# Altium project STB_LightBoard.PrjPcb (part 1 of 10)
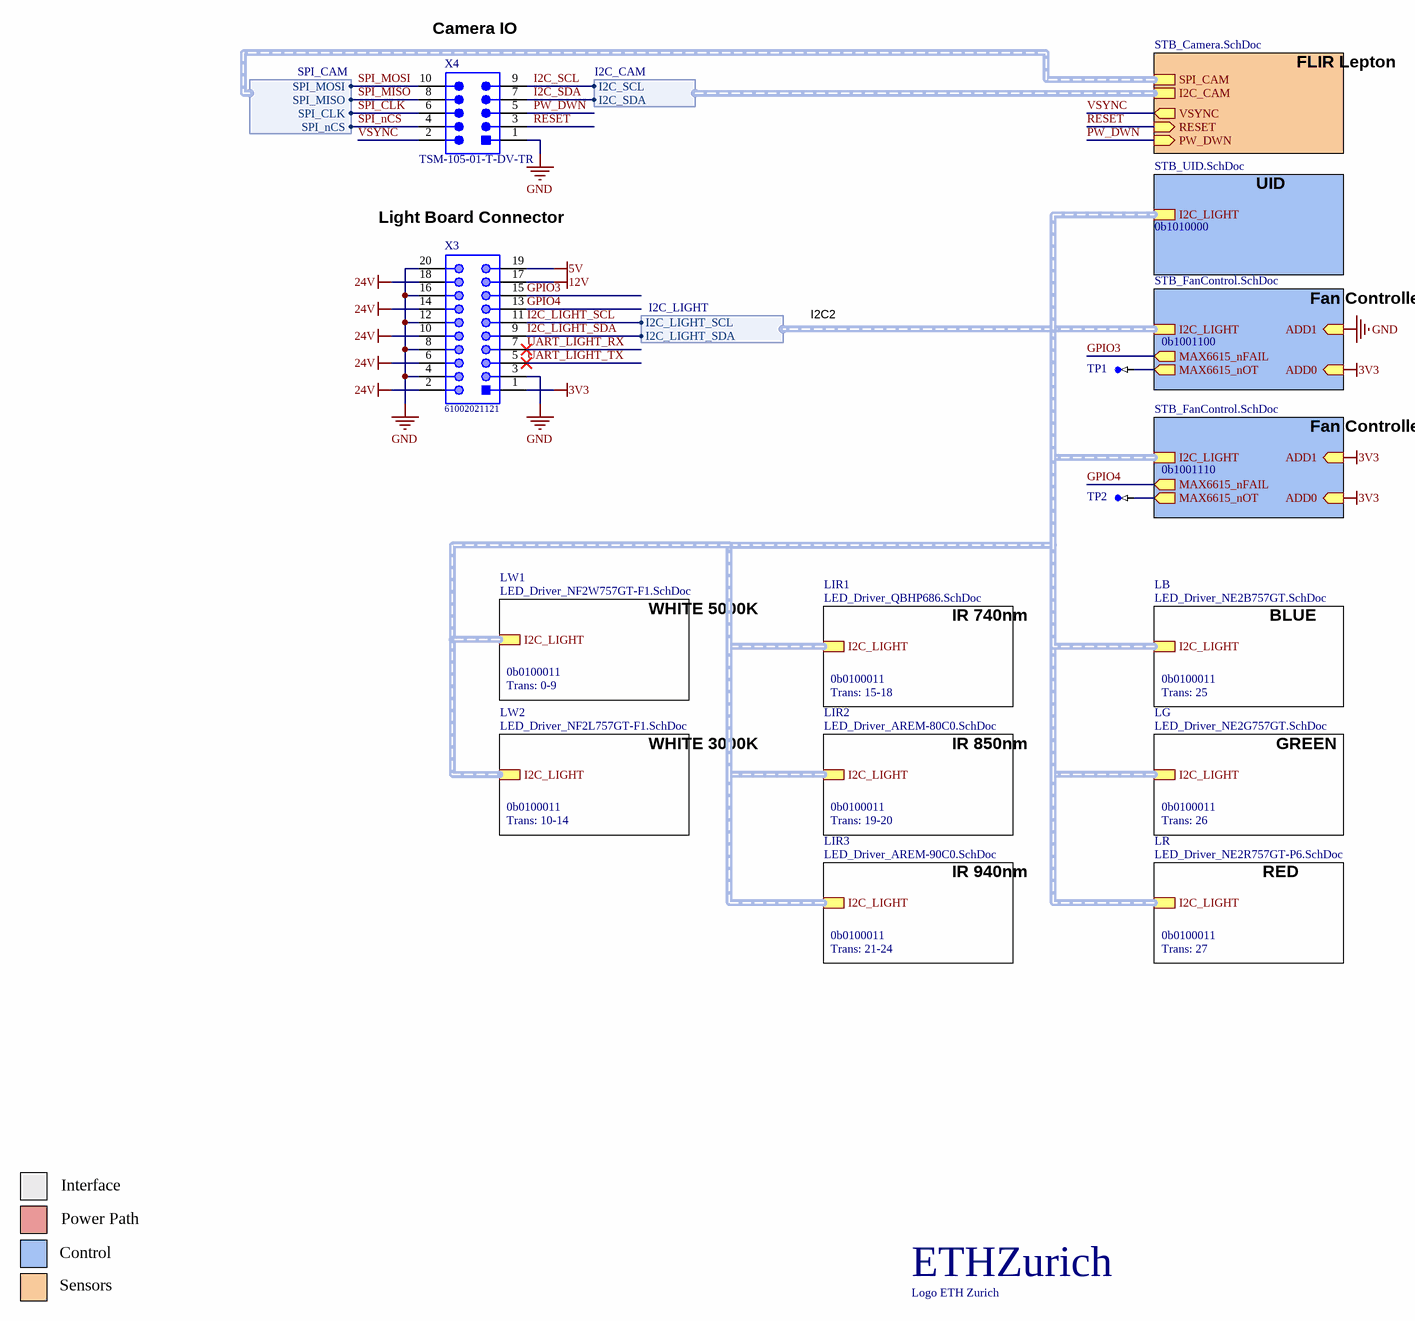
[diagram p0: STB_LightBoard.SchDoc]
21 sheets, 3811 parts. Net scope: hierarchical (ports join the sheet entries above them; power ports are global).
Board file: STB_LightBoard.PcbDoc
Sheets:
  STB_LightBoard.SchDoc
    UID = STB_UID.SchDoc
    TC1 = STB_FanControl.SchDoc
    TC2 = STB_FanControl.SchDoc
    LG = LED_Driver_NE2G757GT.SchDoc
      D26 = STB_Driver_ISL78171.SchDoc
      g_10 = LED_String_NE2G757GT.SchDoc
      g_11 = LED_String_NE2G757GT.SchDoc
      g_12 = LED_String_NE2G757GT.SchDoc
      g_13 = LED_String_NE2G757GT.SchDoc
      g_14 = LED_String_NE2G757GT.SchDoc
      g_15 = LED_String_NE2G757GT.SchDoc
    LIR1 = LED_Driver_QBHP686.SchDoc
      D15 = STB_Driver_ISL78171.SchDoc
      IR740_10 = LED_String_QBHP686.SchDoc
      IR740_11 = LED_String_QBHP686.SchDoc
      IR740_12 = LED_String_QBHP686.SchDoc
      IR740_13 = LED_String_QBHP686.SchDoc
      IR740_14 = LED_String_QBHP686.SchDoc
      IR740_15 = LED_String_QBHP686.SchDoc
      D16 = STB_Driver_ISL78171.SchDoc
      IR740_20 = LED_String_QBHP686.SchDoc
      IR740_21 = LED_String_QBHP686.SchDoc
      IR740_22 = LED_String_QBHP686.SchDoc
      IR740_23 = LED_String_QBHP686.SchDoc
      IR740_24 = LED_String_QBHP686.SchDoc
      IR740_25 = LED_String_QBHP686.SchDoc
      D17 = STB_Driver_ISL78171.SchDoc
      IR740_30 = LED_String_QBHP686.SchDoc
      IR740_31 = LED_String_QBHP686.SchDoc
      IR740_32 = LED_String_QBHP686.SchDoc
      IR740_33 = LED_String_QBHP686.SchDoc
      IR740_34 = LED_String_QBHP686.SchDoc
      IR740_35 = LED_String_QBHP686.SchDoc
      D18 = STB_Driver_ISL78171.SchDoc
      IR740_40 = LED_String_QBHP686.SchDoc
      IR740_41 = LED_String_QBHP686.SchDoc
      IR740_42 = LED_String_QBHP686.SchDoc
      IR740_43 = LED_String_QBHP686.SchDoc
      IR740_44 = LED_String_QBHP686.SchDoc
      IR740_45 = LED_String_QBHP686.SchDoc
    LIR2 = LED_Driver_AREM-80C0.SchDoc
      D19 = STB_Driver_ISL78171.SchDoc
      IR850_10 = LED_String_AREM-80C0.SchDoc
      IR850_11 = LED_String_AREM-80C0.SchDoc
      IR850_12 = LED_String_AREM-80C0.SchDoc
      IR850_13 = LED_String_AREM-80C0.SchDoc
      IR850_14 = LED_String_AREM-80C0.SchDoc
      IR850_15 = LED_String_AREM-80C0.SchDoc
      D20 = STB_Driver_ISL78171.SchDoc
      IR850_20 = LED_String_AREM-80C0.SchDoc
      IR850_21 = LED_String_AREM-80C0.SchDoc
      IR850_22 = LED_String_AREM-80C0.SchDoc
      IR850_23 = LED_String_AREM-80C0.SchDoc
      IR850_24 = LED_String_AREM-80C0.SchDoc
      IR850_25 = LED_String_AREM-80C0.SchDoc
    LIR3 = LED_Driver_AREM-90C0.SchDoc
      D21 = STB_Driver_ISL78171.SchDoc
      IR940_10 = LED_String_AREM-90C0.SchDoc
      IR940_11 = LED_String_AREM-90C0.SchDoc
      IR940_12 = LED_String_AREM-90C0.SchDoc
      IR940_13 = LED_String_AREM-90C0.SchDoc
      IR940_14 = LED_String_AREM-90C0.SchDoc
      IR940_15 = LED_String_AREM-90C0.SchDoc
      D22 = STB_Driver_ISL78171.SchDoc
      IR940_20 = LED_String_AREM-90C0.SchDoc
      IR940_21 = LED_String_AREM-90C0.SchDoc
      IR940_22 = LED_String_AREM-90C0.SchDoc
      IR940_23 = LED_String_AREM-90C0.SchDoc
      IR940_24 = LED_String_AREM-90C0.SchDoc
      IR940_25 = LED_String_AREM-90C0.SchDoc
      D23 = STB_Driver_ISL78171.SchDoc
      IR940_30 = LED_String_AREM-90C0.SchDoc
      IR940_31 = LED_String_AREM-90C0.SchDoc
      IR940_32 = LED_String_AREM-90C0.SchDoc
      IR940_33 = LED_String_AREM-90C0.SchDoc
      IR940_34 = LED_String_AREM-90C0.SchDoc
      IR940_35 = LED_String_AREM-90C0.SchDoc
      D24 = STB_Driver_ISL78171.SchDoc
      IR940_40 = LED_String_AREM-90C0.SchDoc
      IR940_41 = LED_String_AREM-90C0.SchDoc
      IR940_42 = LED_String_AREM-90C0.SchDoc
      IR940_43 = LED_String_AREM-90C0.SchDoc
      IR940_44 = LED_String_AREM-90C0.SchDoc
      IR940_45 = LED_String_AREM-90C0.SchDoc
    LW2 = LED_Driver_NF2L757GT-F1.SchDoc
      D10 = STB_Driver_ISL78171.SchDoc
      W3_10 = LED_String_NF2L757GT-F1.SchDoc
      W3_11 = LED_String_NF2L757GT-F1.SchDoc
      W3_12 = LED_String_NF2L757GT-F1.SchDoc
      W3_13 = LED_String_NF2L757GT-F1.SchDoc
      W3_14 = LED_String_NF2L757GT-F1.SchDoc
      W3_15 = LED_String_NF2L757GT-F1.SchDoc
      D11 = STB_Driver_ISL78171.SchDoc
      W3_20 = LED_String_NF2L757GT-F1.SchDoc
      W3_21 = LED_String_NF2L757GT-F1.SchDoc
      W3_22 = LED_String_NF2L757GT-F1.SchDoc
      W3_23 = LED_String_NF2L757GT-F1.SchDoc
      W3_24 = LED_String_NF2L757GT-F1.SchDoc
      W3_25 = LED_String_NF2L757GT-F1.SchDoc
      D12 = STB_Driver_ISL78171.SchDoc
      W3_30 = LED_String_NF2L757GT-F1.SchDoc
      W3_31 = LED_String_NF2L757GT-F1.SchDoc
      W3_32 = LED_String_NF2L757GT-F1.SchDoc
      W3_33 = LED_String_NF2L757GT-F1.SchDoc
      W3_34 = LED_String_NF2L757GT-F1.SchDoc
      W3_35 = LED_String_NF2L757GT-F1.SchDoc
      D13 = STB_Driver_ISL78171.SchDoc
      W3_40 = LED_String_NF2L757GT-F1.SchDoc
      W3_41 = LED_String_NF2L757GT-F1.SchDoc
      W3_42 = LED_String_NF2L757GT-F1.SchDoc
      W3_43 = LED_String_NF2L757GT-F1.SchDoc
      W3_44 = LED_String_NF2L757GT-F1.SchDoc
      W3_45 = LED_String_NF2L757GT-F1.SchDoc
      D14 = STB_Driver_ISL78171.SchDoc
      W3_50 = LED_String_NF2L757GT-F1.SchDoc
      W3_51 = LED_String_NF2L757GT-F1.SchDoc
      W3_52 = LED_String_NF2L757GT-F1.SchDoc
      W3_53 = LED_String_NF2L757GT-F1.SchDoc
      W3_54 = LED_String_NF2L757GT-F1.SchDoc
      W3_55 = LED_String_NF2L757GT-F1.SchDoc
    LW1 = LED_Driver_NF2W757GT-F1.SchDoc
      D0 = STB_Driver_ISL78171.SchDoc
      D1 = STB_Driver_ISL78171.SchDoc
      D2 = STB_Driver_ISL78171.SchDoc
      D3 = STB_Driver_ISL78171.SchDoc
      D5 = STB_Driver_ISL78171.SchDoc
      D6 = STB_Driver_ISL78171.SchDoc
      D7 = STB_Driver_ISL78171.SchDoc
      D4 = STB_Driver_ISL78171.SchDoc
      D9 = STB_Driver_ISL78171.SchDoc
      D8 = STB_Driver_ISL78171.SchDoc
      W5_10 = LED_String_NF2W757GT-F1.SchDoc
      W5_11 = LED_String_NF2W757GT-F1.SchDoc
      W5_12 = LED_String_NF2W757GT-F1.SchDoc
      W5_13 = LED_String_NF2W757GT-F1.SchDoc
      W5_14 = LED_String_NF2W757GT-F1.SchDoc
      W5_20 = LED_String_NF2W757GT-F1.SchDoc
      W5_21 = LED_String_NF2W757GT-F1.SchDoc
      W5_22 = LED_String_NF2W757GT-F1.SchDoc
      W5_23 = LED_String_NF2W757GT-F1.SchDoc
      W5_24 = LED_String_NF2W757GT-F1.SchDoc
      W5_25 = LED_String_NF2W757GT-F1.SchDoc
      W5_30 = LED_String_NF2W757GT-F1.SchDoc
      W5_31 = LED_String_NF2W757GT-F1.SchDoc
      W5_32 = LED_String_NF2W757GT-F1.SchDoc
      W5_33 = LED_String_NF2W757GT-F1.SchDoc
      W5_34 = LED_String_NF2W757GT-F1.SchDoc
      W5_35 = LED_String_NF2W757GT-F1.SchDoc
      W5_40 = LED_String_NF2W757GT-F1.SchDoc
      W5_41 = LED_String_NF2W757GT-F1.SchDoc
      W5_42 = LED_String_NF2W757GT-F1.SchDoc
      W5_43 = LED_String_NF2W757GT-F1.SchDoc
      W5_44 = LED_String_NF2W757GT-F1.SchDoc
      W5_45 = LED_String_NF2W757GT-F1.SchDoc
      W5_50 = LED_String_NF2W757GT-F1.SchDoc
      W5_51 = LED_String_NF2W757GT-F1.SchDoc
      W5_52 = LED_String_NF2W757GT-F1.SchDoc
      W5_53 = LED_String_NF2W757GT-F1.SchDoc
      W5_54 = LED_String_NF2W757GT-F1.SchDoc
      W5_55 = LED_String_NF2W757GT-F1.SchDoc
      W5_60 = LED_String_NF2W757GT-F1.SchDoc
      W5_61 = LED_String_NF2W757GT-F1.SchDoc
      W5_62 = LED_String_NF2W757GT-F1.SchDoc
      W5_63 = LED_String_NF2W757GT-F1.SchDoc
      W5_64 = LED_String_NF2W757GT-F1.SchDoc
      W5_65 = LED_String_NF2W757GT-F1.SchDoc
      W5_70 = LED_String_NF2W757GT-F1.SchDoc
      W5_71 = LED_String_NF2W757GT-F1.SchDoc
      W5_72 = LED_String_NF2W757GT-F1.SchDoc
      W5_73 = LED_String_NF2W757GT-F1.SchDoc
      W5_74 = LED_String_NF2W757GT-F1.SchDoc
      W5_75 = LED_String_NF2W757GT-F1.SchDoc
      W5_80 = LED_String_NF2W757GT-F1.SchDoc
      W5_81 = LED_String_NF2W757GT-F1.SchDoc
      W5_82 = LED_String_NF2W757GT-F1.SchDoc
      W5_83 = LED_String_NF2W757GT-F1.SchDoc
      W5_84 = LED_String_NF2W757GT-F1.SchDoc
      W5_85 = LED_String_NF2W757GT-F1.SchDoc
      W5_90 = LED_String_NF2W757GT-F1.SchDoc
      W5_91 = LED_String_NF2W757GT-F1.SchDoc
      W5_92 = LED_String_NF2W757GT-F1.SchDoc
      W5_93 = LED_String_NF2W757GT-F1.SchDoc
      W5_94 = LED_String_NF2W757GT-F1.SchDoc
      W5_95 = LED_String_NF2W757GT-F1.SchDoc
      W5_A0 = LED_String_NF2W757GT-F1.SchDoc
      W5_A1 = LED_String_NF2W757GT-F1.SchDoc
      W5_A2 = LED_String_NF2W757GT-F1.SchDoc
      W5_A3 = LED_String_NF2W757GT-F1.SchDoc
      W5_A4 = LED_String_NF2W757GT-F1.SchDoc
      W5_A5 = LED_String_NF2W757GT-F1.SchDoc
      W5_15 = LED_String_NF2W757GT-F1.SchDoc
    LR = LED_Driver_NE2R757GT-P6.SchDoc
      D27 = STB_Driver_ISL78171.SchDoc
      r_10 = LED_String_NE2R757GT-P6.SchDoc
      r_11 = LED_String_NE2R757GT-P6.SchDoc
      r_12 = LED_String_NE2R757GT-P6.SchDoc
      r_13 = LED_String_NE2R757GT-P6.SchDoc
      r_14 = LED_String_NE2R757GT-P6.SchDoc
      r_15 = LED_String_NE2R757GT-P6.SchDoc
    LB = LED_Driver_NE2B757GT.SchDoc
      D25 = STB_Driver_ISL78171.SchDoc
      b_10 = LED_String_NE2B757GT.SchDoc
      b_11 = LED_String_NE2B757GT.SchDoc
      b_12 = LED_String_NE2B757GT.SchDoc
      b_13 = LED_String_NE2B757GT.SchDoc
      b_14 = LED_String_NE2B757GT.SchDoc
      b_15 = LED_String_NE2B757GT.SchDoc
    FLIR = STB_Camera.SchDoc

## Sheet STB_LightBoard.SchDoc: STB Light Board
size A3; Author: mayerph; DrawnBy: mayerph; Organization: PBL; Revision: A; SheetNumber: 1; SheetTotal: 21

### Parts
A1  Logo ETH Zurich  [eth-zurich_5mm]  (no BOM)
TP1  testPoint_1mm  [TP-SM-C-100]  (value not drawn)  (no BOM)
TP2  testPoint_1mm  [TP-SM-C-100]  (value not drawn)  (no BOM)
X3  61002021121  [61002021121]
X4  TSM-105-01-T-DV-TR  [SMTC-TSM-105-01-T-DV_V]

### Sub-sheets
FLIR = STB_Camera.SchDoc: PW_DWN (in), RESET (in), VSYNC (out), I2C_CAM (harness I2C_CAM), SPI_CAM (harness SPI_CAM)
LB = LED_Driver_NE2B757GT.SchDoc: I2C_LIGHT (harness I2C_LIGHT)
LG = LED_Driver_NE2G757GT.SchDoc: I2C_LIGHT (harness I2C_LIGHT)
LIR1 = LED_Driver_QBHP686.SchDoc: I2C_LIGHT (harness I2C_LIGHT)
LIR2 = LED_Driver_AREM-80C0.SchDoc: I2C_LIGHT (harness I2C_LIGHT)
LIR3 = LED_Driver_AREM-90C0.SchDoc: I2C_LIGHT (harness I2C_LIGHT)
LR = LED_Driver_NE2R757GT-P6.SchDoc: I2C_LIGHT (harness I2C_LIGHT)
LW1 = LED_Driver_NF2W757GT-F1.SchDoc: I2C_LIGHT (harness I2C_LIGHT)
LW2 = LED_Driver_NF2L757GT-F1.SchDoc: I2C_LIGHT (harness I2C_LIGHT)
TC1 = STB_FanControl.SchDoc: MAX6615_nOT (out), MAX6615_nFAIL (out), I2C_LIGHT (harness I2C_LIGHT), ADD1 (in), ADD0 (in)
TC2 = STB_FanControl.SchDoc: MAX6615_nOT (out), MAX6615_nFAIL (out), I2C_LIGHT (harness I2C_LIGHT), ADD1 (in), ADD0 (in)
UID = STB_UID.SchDoc: I2C_LIGHT (harness I2C_LIGHT)

### Harnesses
I2C_LIGHT: I2C_LIGHT_SDA, I2C_LIGHT_SCL
I2C_CAM: I2C_SDA, I2C_SCL
SPI_CAM: SPI_MISO, SPI_MOSI, SPI_CLK, SPI_nCS

### Nets
3V3: X3.1 ; sheet TC1/ADD0, sheet TC2/ADD1, sheet TC2/ADD0
5V: X3.19
12V: X3.17
24V: X3.2 X3.6 X3.10 X3.14 X3.18
GND: X3.3 X3.4 X3.8 X3.12 X3.16 X3.20 X4.1 ; sheet TC1/ADD1
GPIO3: X3.15 ; sheet TC1/MAX6615_nFAIL
GPIO4: X3.13 ; sheet TC2/MAX6615_nFAIL
I2C_LIGHT_SCL: X3.11 ; sheet UID/I2C_LIGHT.I2C_LIGHT_SCL
I2C_LIGHT_SDA: X3.9 ; sheet UID/I2C_LIGHT.I2C_LIGHT_SDA
I2C_SCL: X4.9 ; sheet FLIR/I2C_CAM.I2C_SCL
I2C_SDA: X4.7 ; sheet FLIR/I2C_CAM.I2C_SDA
PW_DWN: X4.5 ; sheet FLIR/PW_DWN
RESET: X4.3 ; sheet FLIR/RESET
SPI_CLK: X4.6 ; sheet FLIR/SPI_CAM.SPI_CLK
SPI_MISO: X4.8 ; sheet FLIR/SPI_CAM.SPI_MISO
SPI_MOSI: X4.10 ; sheet FLIR/SPI_CAM.SPI_MOSI
SPI_nCS: X4.4 ; sheet FLIR/SPI_CAM.SPI_nCS
UART_LIGHT_RX: X3.7
UART_LIGHT_TX: X3.5
VSYNC: X4.2 ; sheet FLIR/VSYNC
NetR48_TC1_1: TP1.TP ; sheet TC1/MAX6615_nOT
NetR48_TC2_1: TP2.TP ; sheet TC2/MAX6615_nOT

### Buses and harness runs
harness sheet LB/I2C_LIGHT = sheet LG/I2C_LIGHT = sheet LIR1/I2C_LIGHT = sheet LIR2/I2C_LIGHT = sheet LIR3/I2C_LIGHT = sheet LR/I2C_LIGHT = sheet LW1/I2C_LIGHT = sheet LW2/I2C_LIGHT = sheet TC1/I2C_LIGHT = sheet TC2/I2C_LIGHT = sheet UID/I2C_LIGHT

### Notes on the sheet
- (near X4) Camera IO
- FLIR Lepton
- (near X3) Light Board Connector
- 0b1010000
- UID
- Fan Controller 1
- I2C2
- (near TP1) 0b1001100
- Fan Controller 2
- (near TP2) 0b1001110
- WHITE 5000K
- IR 740nm
- BLUE
- 0b0100011
- Trans: 0-9
- Trans: 15-18
- Trans: 25
- WHITE 3000K
- IR 850nm
- GREEN
- Trans: 10-14
- Trans: 19-20
- Trans: 26
- IR 940nm
- RED
- Trans: 21-24
- Trans: 27
- Interface
- Power Path
- Control
- Sensors
- 1
- 2
- 3
- 4
- 5
- 6
- 7
- 8
- A
- B
- C
- D
- Project:
- Date:
- Drawing number:
- Rev:
- Format:
- A3
- Drawn by:
- Laboratory:
- Page
- Sheet:
- of
- File:
- (in symbol CMP-00038-1) ETHZurich

### Library data of the parts
A1 = CMP-00038-1
TP1 TP2 = testPoint_1mm: testPoint 1mm
X3 = CMP-1502-01036-1: SMT Vertical Pin Header WR-PHD, Pitch 2.54 mm, Dual Row, 20 pins; Manufacturer: Wurth Elektronik; Manufacturer Series: 6100; Pin Number: 20; Gender: Male; Rated Current: 3A; Working Voltage: 250VAC; Pitch: 2.54mm; Contact Resistance: 20mOhm; Withstanding Voltage: 500VAC; Connector Type: BOARD CONNECTOR; Option: General Purpose; Filter Feature: No; Body/Shell Style: RECEPTACLE; Number of Rows Loaded: 2; Contact Pattern: RECTANGULAR; Contact Style: SQ PIN-SKT; Number Of Connectors: 1; Dielectric Withstanding Voltage (AC): 500V; Insulation Resistance: 1GR; Mating Contact Pitch: 0.1inch; Body Breadth: 0.2inch; Body Depth: 0.142inch; Body Length: 1inch; Mounting Option 1: LOCKING; PCB Contact Row Spacing: 5.4102mm; Reference Standard: UL; Reliability: COMMERCIAL; Package Reference: 61002021121; Part Number: 61002021121; Datasheet URL: https://katalog.we-online.de/em/datasheet/6100xx21121.pdf; Mounting Technology: SMT; Orientation: Vertical; Row Number: Dual; Publisher: WurthElektronik; Packaging: Tube; Manufacturer URL: http://www.we-online.de; Operating Temperature: -40to125degC; Supplier 1: Digi-Key; Supplier Part Number 1: 732-5468-5-ND; Manufacturer Part Number: 61002021121; RoHS: Yes; Category: Connectors; Stock 1: 578; Pricing 1: 1=3.72000, 10=3.15900, 24=2.63208, 48=2.19292, 96=1.99302, 192=1.81302 (USD); Mount: Board; Contact Material: Copper Alloy; Contact Finish - Mating: GOLD; Contact Finish - Termination: Gold (Au) - with Nickel (Ni) barrier; Insulation Material: Polyamide; Insulation Color: Black; Min Operating Temperature: -40°C; Max Operating Temperature: 125°C; JESD-609 Code: e4; Contact Gender: Male; Mixed Contacts: No; Termination: SMD/SMT; Number of Contacts: 20; Mounting Style: STRAIGHT; Number Of PCB Rows: 2; PCB Contact Pattern: RECTANGULAR; Rated Current (Signal): 3A; Terminal Pitch: 2.54mm; Mating Contact Row Spacing: 0.1inch; Flammability Rating: UL94 V-0; REACH SVHC: Yes; RoHS Compliant: Yes; DIN Conformance: No; IEC Conformance: No; MIL Conformance: No; ComponentLink1URL: https://datasheet.ciiva.com:443/pdfs/VipMasterIC/IC/MIDC/MIDCS04347/MIDCS04347-1.pdf?src-supplier=IHS+Markit; ComponentLink1Description: https://datasheet.ciiva.com:443/pdfs/VipMasterIC/IC/MIDC/MIDCS04347/MIDCS04347-1.pdf?src-supplier=IHS+Markit; ComponentLink2URL: https://katalog.we-online.de/em/datasheet/6100xx21121.pdf?src-supplier=Digi-Key; ComponentLink2Description: https://katalog.we-online.de/em/datasheet/6100xx21121.pdf?src-supplier=Digi-Key; ComponentLink3URL: http://www.farnell.com/cad/1737271.pdf?src-supplier=Element14; ComponentLink3Description: http://www.farnell.com/cad/1737271.pdf?src-supplier=Element14
X4 = CMP-1707-00003-3: Male Header, Pitch 2.54 mm, 2 x 5 Position, Height 9.65 mm, -55 to 105 degC, RoHS, Tape and Reel; Manufacturer: Samtec; Manufacturer Series: TSM; Description: Board Connector, 10 Contact(s), 2 Row(s), Male, Straight, 0.1 inch Pitch, Surface Mount Terminal, Locking, Black Insulator, Receptacle; Connector Type: BOARD CONNECTOR; Option: General Purpose; Body/Shell Style: RECEPTACLE; Filter Feature: No; Number of Rows Loaded: 2; Number of Contacts: 10; Mating Information: MULTIPLE MATING PARTS AVAILABLE; Contact Pattern: RECTANGULAR; Contact Style: SQ PIN-SKT; Number Of Connectors: 1; Body Breadth: 0.2inch; Mating Contact Pitch: 0.1inch; Mounting Option 1: LOCKING; Reference Standard: UL; Reliability: COMMERCIAL; Max Operating Temperature: 105 degC; ComponentLink1URL: http://www.samtec.com/; Min Operating Temperature: -55 degC; ComponentLink2URL: http://suddendocs.samtec.com/catalog_english/tsm.pdf; ComponentLink2Description: Datasheet; Mounting Technology: Surface Mount; Pins: 10; DatasheetVersion: Rev. 31DEC15; PackageDescription: Male Header, Pitch 2.54 mm, 2 x 5 Position, Height 9.65 mm; Height: 9.65 mm; ComponentLink3URL: http://suddendocs.samtec.com/prints/tsm-dv-footprint.pdf; Packaging: Tape and Reel; Radiation Hardening: No; ComponentLink3Description: Package Specification; RoHSCompliant: True; REACH SVHC: No SVHC; Length: 12.7 mm; PartNumber: TSM-105-01-T-DV-TR; Mount: Surface Mount; ComponentLink1Description: Manufacturer URL; Supplier 1: Digi-Key; Supplier Part Number 1: SAM15490DKR-ND; Manufacturer Part Number: TSM-105-01-T-DV-TR; RoHS: Yes; Category: Headers and Wire Housings; Stock 1: 302; Pricing 1: 1=1.29000, 10=1.08900, 100=0.97770 (USD); Contact Finish - Mating: MATTE TIN OVER NICKEL (50); Contact Finish - Termination: Tin (Sn) - with Nickel (Ni) barrier; Contact Material: Bronze; Insulation Material: Polymer; Insulation Color: Black; JESD-609 Code: e3; Contact Gender: Male; Mixed Contacts: No; Mounting Style: STRAIGHT; Termination: SMD/SMT; Number Of PCB Rows: 2; PCB Contact Pattern: RECTANGULAR; Terminal Pitch: 2.54mm; Mating Contact Row Spacing: 0.1inch; DIN Conformance: No; IEC Conformance: No; MIL Conformance: No; Reach SVHC Compliant: Yes; RoHS Compliant: Yes; ComponentLink4URL: https://datasheet.ciiva.com:443/pdfs/VipMasterIC/IC/SAMI/SAMI-S-A0001470581/SAMI-S-A0001470581-1.pdf?src-supplier=IHS+Markit; ComponentLink4Description: https://datasheet.ciiva.com:443/pdfs/VipMasterIC/IC/SAMI/SAMI-S-A0001470581/SAMI-S-A0001470581-1.pdf?src-supplier=IHS+Markit; ComponentLink5URL: http://www.farnell.com/datasheets/2186767.pdf?src-supplier=Farnell; ComponentLink5Description: http://www.farnell.com/datasheets/2186767.pdf?src-supplier=Farnell; ComponentLink6URL: http://components.arrow.com/part/dataview/2684870S6011475N1004?src-supplier=Arrow+Electronics; ComponentLink6Description: http://components.arrow.com/part/dataview/2684870S6011475N1004?src-supplier=Arrow+Electronics; ComponentLink7URL: http://suddendocs.samtec.com/prints/tsm-1xx-xx-xxx-xx-x-xxx-x-mkt.pdf?src-supplier=Digi-Key; ComponentLink7Description: http://suddendocs.samtec.com/prints/tsm-1xx-xx-xxx-xx-x-xxx-x-mkt.pdf?src-supplier=Digi-Key; ComponentLink8URL: http://www.samtec.com/documents/webfiles/pdf/TSM.PDF?src-supplier=Avnet; ComponentLink8Description: http://www.samtec.com/documents/webfiles/pdf/TSM.PDF?src-supplier=Avnet

## Sheet STB_UID.SchDoc: STB Light Board - UID
size A4; Author: flmoll; DrawnBy: flmoll; Organization: PBL; Revision: A; SheetNumber: 13; SheetTotal: 21
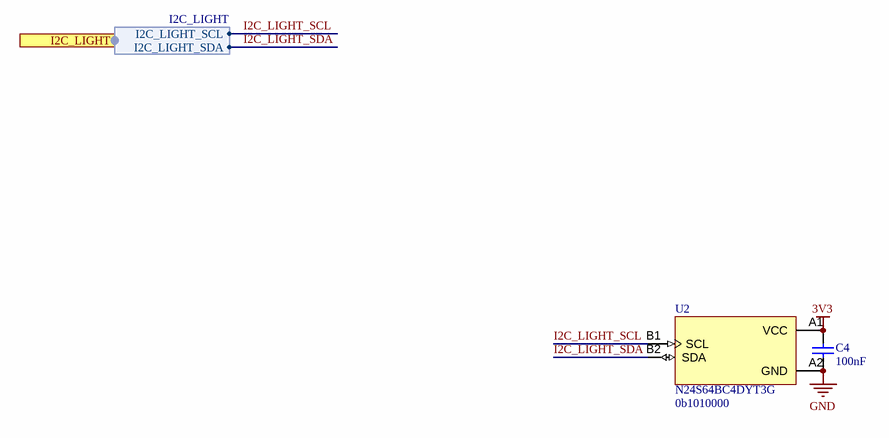
[diagram p1: STB_UID.SchDoc]

### Parts
C4  100nF  [CAPC1050X55X23LL05T13]
U2  N24S64BC4DYT3G  [4-WLCSP (0.77x0.77)]

### Ports
I2C_LIGHT (harness I2C_LIGHT, see STB_LightBoard[5A], LED_Driver_AREM-80C0[1A], LED_Driver_AREM-90C0[1A], LED_Driver_NE2B757GT[2B], LED_Driver_NE2G757GT[2B], LED_Driver_NE2R757GT-P6[2B], LED_Driver_NF2L757GT-F1[1A], LED_Driver_NF2W757GT-F1[1A], LED_Driver_QBHP686[1A], STB_Driver_ISL78171[1A], STB_FanControl[1A])

### Harnesses
I2C_LIGHT: I2C_LIGHT_SDA, I2C_LIGHT_SCL

### Nets
3V3: C4.2 U2.A1(VCC)
GND: C4.1 U2.A2(GND)
I2C_LIGHT_SCL: U2.B1(SCL) ; port I2C_LIGHT.I2C_LIGHT_SCL
I2C_LIGHT_SDA: U2.B2(SDA) ; port I2C_LIGHT.I2C_LIGHT_SDA

### Notes on the sheet
- (near U2) 0b1010000
- 1
- 2
- 3
- 4
- A
- B
- C
- Project:
- D
- Date:
- Drawing number:
- Rev:
- Format:
- A4 Q
- Drawn by:
- Laboratory:
- Page
- Sheet:
- of
- File:

### Library data of the parts
C4 = CMP-2000-05439-1: Chip Capacitor, 100 nF, +/- 10%, 16 V, -55 to 125 degC, 0402 (1005 Metric), RoHS, Tape and Reel; Manufacturer: Samsung Electro-Mechanics; Manufacturer Part Number: CL05B104KO5NNNC; Dielectric: X7R; Rated Voltage: 16V; Dielectric Material: Ceramic; Multilayer: Yes; Case Size/Dimension: 0402; Tolerance (%): ±10%; Value: 100nF; Manufacturer URL: http://www.samsungsem.com/global/index.jsp; Datasheet URL: https://datasheet.ciiva.com/29198/458718-da-01-en-vs-kondensator-0402-29198423.pdf; Datasheet Version: Nov-10; Supplier 1: Digi-Key; Supplier Part Number 1: 1276-1001-6-ND; RoHS: Yes; Category: Ceramic Capacitors; Stock 1: 24854634; Pricing 1: 1=0.10000, 10=0.02400, 50=0.01300, 100=0.01050, 500=0.00752, 1000=0.00592, 2500=0.00538, 5000=0.00495 (USD); Mount: Surface Mount; Number of Pins: 2; Package Shape: Rectangular; Size Code: 0402; Terminal Finish: Nickel; Min Operating Temperature: -55°C; Max Operating Temperature: 125°C; JESD-609 Code: e3; Capacitor Type: Ceramic; Negative Tolerance: 10%; Packaging: Tape and Reel; Positive Tolerance: 10%; Rated DC Voltage (URdc): 16V; Temperature Characteristics Code: X7R; Termination: Wraparound; Package Style: SMTMeter; Length: 1mm; Width: 0.5mm; Height: 0.55mm; REACH SVHC: Yes; RoHS Compliant: Yes; ComponentLink1URL: https://datasheet.ciiva.com:443/pdfs/VipMasterIC/IC/SEMS/SEMS-S-A0008384515/SEMS-S-A0008872921-1.pdf?src-supplier=IHS+Markit; ComponentLink1Description: https://datasheet.ciiva.com:443/pdfs/VipMasterIC/IC/SEMS/SEMS-S-A0008384515/SEMS-S-A0008872921-1.pdf?src-supplier=IHS+Markit; ComponentLink2URL: https://datasheet.ciiva.com/26920/getdatasheetpartid-359683-26920169.pdf?src-supplier=Verical; ComponentLink2Description: https://datasheet.ciiva.com/26920/getdatasheetpartid-359683-26920169.pdf?src-supplier=Verical; ComponentLink3URL: https://datasheet.ciiva.com/29198/458718-da-01-en-vs-kondensator-0402-29198423.pdf?src-supplier=Conrad; ComponentLink3Description: https://datasheet.ciiva.com/29198/458718-da-01-en-vs-kondensator-0402-29198423.pdf?src-supplier=Conrad; ComponentLink4URL: https://datasheet.ciiva.com/26309/mlcc-catalogdownload2013-eng-26309003.pdf?src-supplier=Distrelec; ComponentLink4Description: https://datasheet.ciiva.com/26309/mlcc-catalogdownload2013-eng-26309003.pdf?src-supplier=Distrelec; ComponentLink5URL: https://datasheet.ciiva.com/16208/cl05b104kq5nnnc-16208343.pdf?src-supplier=Future+Electronics; ComponentLink5Description: https://datasheet.ciiva.com/16208/cl05b104kq5nnnc-16208343.pdf?src-supplier=Future+Electronics
U2 = CMP-02089-1: Memory IC 64Kb (8K x 8) I²C 1 MHz 400 ns 4-WLCSP (0.77x0.77); Mfr: onsemi; Manufacturer: ON Semiconductor; Product Status: Active; Memory Type: Non-Volatile; Memory Format: EEPROM; Clock Frequency: 1 MHz; Write Cycle Time - Word, Page: 5ms; Access Time: 400 ns; Voltage - Supply: 1.7V ~ 5.5V; Base Product Number: N24S64; Description: EEPROM, 8KX8, Serial, CMOS, PBGA4; Technology: -; Memory Size: 64Kb (8K x 8); Memory Interface: I²C; Operating Temperature: -40°C ~ 85°C (TA); Mounting Type: Surface Mount; Package / Case: 4-XFBGA, WLCSP; Supplier Device Package: 4-WLCSP (0.77x0.77); Supplier 1: Digi-Key; Supplier Part Number 1: 488-N24S64BC4DYT3GDKR-ND; Manufacturer Part Number: N24S64BC4DYT3G; RoHS: Yes; Category: EEPROM

## Sheet STB_FanControl.SchDoc: STB Light Board - Fan Controller
size A4; Author: mayerph; DrawnBy: mayerph; Organization: PBL; Revision: A; SheetNumber: 11; SheetTotal: 20
Used 2 times, as channels TC1, TC2. Parts and nets are listed once, with the designators drawn on the sheet.
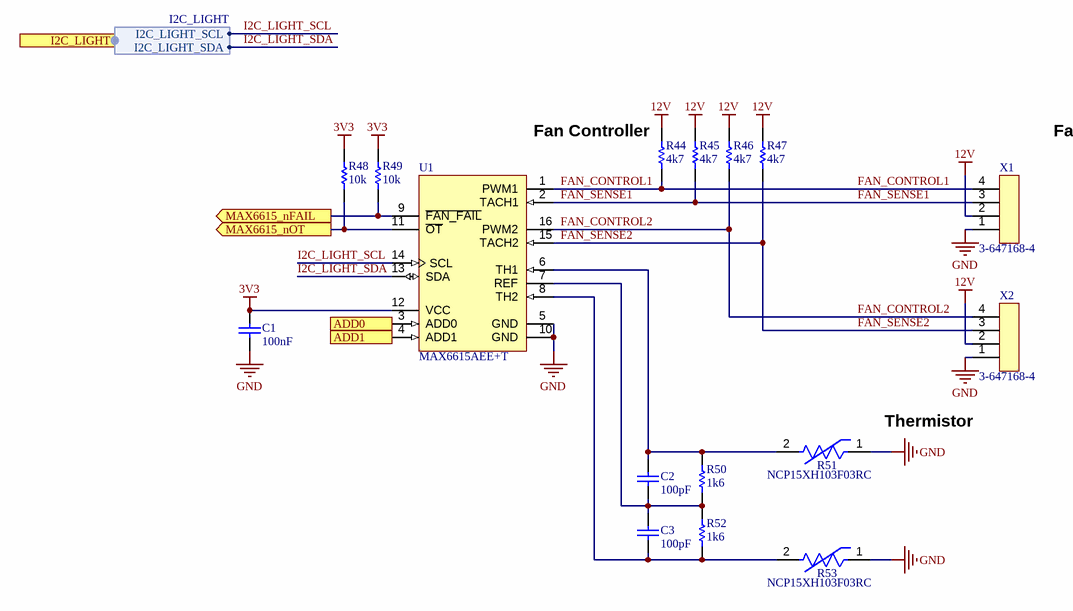
[diagram p2: STB_FanControl.SchDoc]

### Parts
C1  100nF  [CAPC1050X55X23LL05T13]
C2  100pF  [CAPC1005X56X25LL10T15]
C3  100pF  [CAPC1005X56X25LL10T15]
R44  4k7  [RESC1005X40X25LL05T10]
R45  4k7  [RESC1005X40X25LL05T10]
R46  4k7  [RESC1005X40X25LL05T10]
R47  4k7  [RESC1005X40X25LL05T10]
R48  10k  [RESC1005X40X25LL05T05]
R49  10k  [RESC1005X40X25LL05T05]
R50  1k6  [RESC1005X40X25LL05T10]
R51  NCP15XH103F03RC  [FP-NCP15-NCU15-0_05-IPC_C]
R52  1k6  [RESC1005X40X25LL05T10]
R53  NCP15XH103F03RC  [FP-NCP15-NCU15-0_05-IPC_C]
U1  MAX6615AEE+T  [MAXM-E16+1_M]
X1  3-647168-4  [3-647168-4]
X2  3-647168-4  [3-647168-4]

### Ports
ADD0 (in, see STB_LightBoard[6B]), ADD1 (in, see STB_LightBoard[6B]), I2C_LIGHT (harness I2C_LIGHT, see STB_LightBoard[5B], LED_Driver_AREM-80C0[1A], LED_Driver_AREM-90C0[1A], LED_Driver_NE2B757GT[2B], LED_Driver_NE2G757GT[2B], LED_Driver_NE2R757GT-P6[2B], LED_Driver_NF2L757GT-F1[1A], LED_Driver_NF2W757GT-F1[1A], LED_Driver_QBHP686[1A], STB_Driver_ISL78171[1A], STB_UID[1A]), MAX6615_nFAIL (out, see STB_LightBoard[5B]), MAX6615_nOT (out, see STB_LightBoard[5B])

### Harnesses
I2C_LIGHT: I2C_LIGHT_SDA, I2C_LIGHT_SCL

### Nets
3V3: C1.2 R48.2 R49.2 U1.12(VCC)
12V: R44.2 R45.2 R46.2 R47.2 X1.2 X2.2
GND: C1.1 R51.1 R53.1 U1.5(GND) U1.10(GND) X1.1 X2.1
ADD0: U1.3(ADD0) ; port ADD0
ADD1: U1.4(ADD1) ; port ADD1
FAN_CONTROL1: R44.1 U1.1(PWM1) X1.4
FAN_CONTROL2: R46.1 U1.16(PWM2) X2.4
FAN_SENSE1: R45.1 U1.2(TACH1) X1.3
FAN_SENSE2: R47.1 U1.15(TACH2) X2.3
I2C_LIGHT_SCL: U1.14(SCL) ; port I2C_LIGHT.I2C_LIGHT_SCL
I2C_LIGHT_SDA: U1.13(SDA) ; port I2C_LIGHT.I2C_LIGHT_SDA
MAX6615_nFAIL: R49.1 U1.9(~{FAN_FAIL}) ; port MAX6615_nFAIL
MAX6615_nOT: R48.1 U1.11(~{OT}) ; port MAX6615_nOT
NetC2_1: C2.1 C3.2 R50.1 R52.2 U1.7(REF)
NetC2_2: C2.2 R50.2 R51.2 U1.6(TH1)
NetC3_1: C3.1 R52.1 R53.2 U1.8(TH2)

### Channels
TC1: designators end in _TC1; ports ADD0=3V3 ADD1=GND MAX6615_nFAIL=GPIO3 MAX6615_nOT=NetR48_TC1_1
TC2: designators end in _TC2; ports ADD0=3V3 ADD1=3V3 MAX6615_nFAIL=GPIO4 MAX6615_nOT=NetR48_TC2_1

### Notes on the sheet
- Fan Controller
- (near X1) Fan Connector
- (near R51) Thermistor
- 1
- 2
- 3
- 4
- A
- B
- C
- Project:
- D
- Date:
- Drawing number:
- Rev:
- Format:
- A4 Q
- Drawn by:
- Laboratory:
- Page
- Sheet:
- of
- File:

### Library data of the parts
C1 = CMP-2000-05439-1: as C4 on sheet STB_UID; Case Size/Dimension: 0402; Tolerance (%): ±10%; Value: 100nF; Manufacturer URL: http://www.samsungsem.com/global/index.jsp; Datasheet URL: https://datasheet.ciiva.com/29198/458718-da-01-en-vs-kondensator-0402-29198423.pdf; Datasheet Version: Nov-10; Supplier 1: Digi-Key; Supplier Part Number 1: 1276-1001-6-ND; RoHS: Yes; Category: Ceramic Capacitors; Stock 1: 24854634; Pricing 1: 1=0.10000, 10=0.02400, 50=0.01300, 100=0.01050, 500=0.00752, 1000=0.00592, 2500=0.00538, 5000=0.00495 (USD); Mount: Surface Mount; Number of Pins: 2; Package Shape: Rectangular; Size Code: 0402; Terminal Finish: Nickel; Min Operating Temperature: -55°C; Max Operating Temperature: 125°C; JESD-609 Code: e3; Capacitor Type: Ceramic; Negative Tolerance: 10%; Packaging: Tape and Reel; Positive Tolerance: 10%; Rated DC Voltage (URdc): 16V; Temperature Characteristics Code: X7R; Termination: Wraparound; Package Style: SMTMeter; Length: 1mm; Width: 0.5mm; Height: 0.55mm; REACH SVHC: Yes; RoHS Compliant: Yes; ComponentLink1URL: https://datasheet.ciiva.com:443/pdfs/VipMasterIC/IC/SEMS/SEMS-S-A0008384515/SEMS-S-A0008872921-1.pdf?src-supplier=IHS+Markit; ComponentLink1Description: https://datasheet.ciiva.com:443/pdfs/VipMasterIC/IC/SEMS/SEMS-S-A0008384515/SEMS-S-A0008872921-1.pdf?src-supplier=IHS+Markit; ComponentLink2URL: https://datasheet.ciiva.com/26920/getdatasheetpartid-359683-26920169.pdf?src-supplier=Verical; ComponentLink2Description: https://datasheet.ciiva.com/26920/getdatasheetpartid-359683-26920169.pdf?src-supplier=Verical; ComponentLink3URL: https://datasheet.ciiva.com/29198/458718-da-01-en-vs-kondensator-0402-29198423.pdf?src-supplier=Conrad; ComponentLink3Description: https://datasheet.ciiva.com/29198/458718-da-01-en-vs-kondensator-0402-29198423.pdf?src-supplier=Conrad; ComponentLink4URL: https://datasheet.ciiva.com/26309/mlcc-catalogdownload2013-eng-26309003.pdf?src-supplier=Distrelec; ComponentLink4Description: https://datasheet.ciiva.com/26309/mlcc-catalogdownload2013-eng-26309003.pdf?src-supplier=Distrelec; ComponentLink5URL: https://datasheet.ciiva.com/16208/cl05b104kq5nnnc-16208343.pdf?src-supplier=Future+Electronics; ComponentLink5Description: https://datasheet.ciiva.com/16208/cl05b104kq5nnnc-16208343.pdf?src-supplier=Future+Electronics
C2 C3 = CMP-2008-02464-1: Manufacturer: AVX Interconnect / Elco; Part Number: 04023A101KAT2A; Dielectric Material: Ceramic; Multilayer: Yes; Negative Tolerance: 10%; Rated DC Voltage (URdc): 25V; Temperature Characteristics Code: C0G; Supplier 1: Digi-Key; Supplier Part Number 1: 478-12608-6-ND; Manufacturer Part Number: 04023A101KAT2A; RoHS: Yes; Category: Ceramic Capacitors; Stock 1: 32266; Pricing 1: 1=0.11000, 10=0.07800, 50=0.04240, 100=0.03460, 500=0.02474, 1000=0.01944, 2500=0.01768, 5000=0.01626 (USD); Mount: Surface Mount; Number of Pins: 2; Package Shape: Rectangular; Size Code: 0402; Terminal Finish: Nickel; Min Operating Temperature: -55°C; Max Operating Temperature: 125°C; JESD-609 Code: e3; Value: 100pF; Capacitor Type: Ceramic; Packaging: Tape and Reel; Positive Tolerance: 10%; Termination: Wraparound; Package Style: SMTMeter; Length: 1mm; Width: 0.5mm; Height: 0.56mm; REACH SVHC: Yes; RoHS Compliant: Yes; ComponentLink1URL: https://datasheet.ciiva.com:443/pdfs/VipMasterIC/IC/AVXC/AVXC-S-A0008899940/AVXC-S-A0008899940-1.pdf?src-supplier=IHS+Markit; ComponentLink1Description: https://datasheet.ciiva.com:443/pdfs/VipMasterIC/IC/AVXC/AVXC-S-A0008899940/AVXC-S-A0008899940-1.pdf?src-supplier=IHS+Markit; ComponentLink2URL: https://datasheet.ciiva.com/26949/getdatasheetpartid-709922-26949850.pdf?src-supplier=Verical; ComponentLink2Description: https://datasheet.ciiva.com/26949/getdatasheetpartid-709922-26949850.pdf?src-supplier=Verical; ComponentLink3URL: https://datasheet.ciiva.com/206/ccog-206339.pdf?src-supplier=Digi-Key; ComponentLink3Description: https://datasheet.ciiva.com/206/ccog-206339.pdf?src-supplier=Digi-Key; ComponentLink4URL: https://datasheet.ciiva.com/7348/759117-7348584.pdf?src-supplier=Newark; ComponentLink4Description: https://datasheet.ciiva.com/7348/759117-7348584.pdf?src-supplier=Newark; ComponentLink5URL: https://datasheet.ciiva.com/2990/ccog-2990123.pdf?src-supplier=Avnet; ComponentLink5Description: https://datasheet.ciiva.com/2990/ccog-2990123.pdf?src-supplier=Avnet; ComponentLink6URL: https://datasheet.ciiva.com/28453/1796416-28453629.pdf?src-supplier=Element14; ComponentLink6Description: https://datasheet.ciiva.com/28453/1796416-28453629.pdf?src-supplier=Element14
R44-R47 = CMP-1011-00586-2: Manufacturer: Yageo / Phycomp; Part Number: RC0402FR-074K7L; Tolerance: 1%; Rated Power Dissipation (P): 62.5mW; Rated Temperature: 70°C; Value: 4.7 kOhm; Temperature Coefficient: 100ppm/°C; Working Voltage: 50V; Additional Feature: LASER TRIMMABLE; Package Height: 0.35mm; Package Length: 1mm; Package Width: 0.5mm; Supplier 1: Digi-Key; Supplier Part Number 1: 311-4.7KLRDKR-ND; Manufacturer Part Number: RC0402FR-074K7L; RoHS: Yes; Category: Chip SMD Resistors; Stock 1: 23638739; Pricing 1: 1=0.10000, 10=0.01500, 100=0.00600, 1000=0.00267, 2500=0.00232, 5000=0.00192 (USD); Mount: Surface Mount; Number of Pins: 2; Package Shape: Rectangular; Size Code: 0402; Terminal Finish: Nickel; Min Operating Temperature: -55°C; Max Operating Temperature: 155°C; Resistor Type: FIXED RESISTOR; Packaging: Tape and Reel; Technology: METAL GLAZE/THICK FILM; Termination: Wraparound; JESD-609 Code: e3; Construction: Chip; Package Style: SMTMeter; REACH SVHC: Yes; RoHS Compliant: Yes; ComponentLink1URL: https://datasheet.ciiva.com:443/pdfs/VipMasterIC/IC/YAGO/YAGO-S-A0008145938/YAGO-S-A0008145938-1.pdf?src-supplier=IHS+Markit; ComponentLink1Description: https://datasheet.ciiva.com:443/pdfs/VipMasterIC/IC/YAGO/YAGO-S-A0008145938/YAGO-S-A0008145938-1.pdf?src-supplier=IHS+Markit; ComponentLink2URL: https://datasheet.ciiva.com/22661/1686128-22661342.pdf?src-supplier=Element14; ComponentLink2Description: https://datasheet.ciiva.com/22661/1686128-22661342.pdf?src-supplier=Element14; ComponentLink3URL: https://datasheet.ciiva.com/7850/1018594-7850022.pdf?src-supplier=Element14; ComponentLink3Description: https://datasheet.ciiva.com/7850/1018594-7850022.pdf?src-supplier=Element14; ComponentLink4URL: https://datasheet.ciiva.com/7850/1018594-7850023.pdf?src-supplier=Element14; ComponentLink4Description: https://datasheet.ciiva.com/7850/1018594-7850023.pdf?src-supplier=Element14; ComponentLink5URL: https://datasheet.ciiva.com/15215/getdatasheetpartid-328119-15215035.pdf?src-supplier=Verical; ComponentLink5Description: https://datasheet.ciiva.com/15215/getdatasheetpartid-328119-15215035.pdf?src-supplier=Verical
R48 R49 = CMP-2000-07588-1: Chip Resistor, 10 KOhm, +/- 1%, 0.1 W, -55 to 155 degC, 0402 (1005 Metric), RoHS, Tape and Reel; Manufacturer: Panasonic; Manufacturer Part Number: ERJ-2RKF1002X; Power Rating: 100mW; Voltage Rating: 50V; Value: 10 KOhm; Case\/Package: 0402; Temperature Coefficient: 100ppm\/degreesC; Rated Temperature: 70°C; Package Height: 0.35mm; Package Length: 1mm; Package Width: 0.5mm; Reference Standard: AEC-Q200; RoHSCompliant: True; Lead Free: LeadFree; Package Quantity: 1; Contact Plating: Tin; Length: 1mm; Radiation Hardening: No; REACH SVHC: NoSVHC; Max Operating Temperature: 155degC; Depth: 0.5mm; Case Code (Imperial): 0402; Military Standard: Not; Package Description: 2-Pin Surface Mount Device, Body 1 x 0.5 mm; Termination: SMD/SMT; Case Code (Metric): 1005; Height: 0.35mm; Packaging: TapeandReel; Voltage Rating (DC): 50V; Package Reference: 402; Number of Pins: 2; Tolerance: 1%; Mounting Technology: SurfaceMount; Width: 0.02inch; Mount: SurfaceMount; Datasheet URL: https://industrial.panasonic.com/cdbs/www-data/pdf/RDA0000/AOA0000C304.pdf; Composition: ThickFilm; Datasheet Version: 02/2017; Manufacturer URL: http://www.panasonic.com/; Max Power Dissipation: 100mW; Number of Terminations: 2; Min Operating Temperature: -55degC; Supplier 1: Digi-Key; Supplier Part Number 1: P10.0KLDKR-ND; RoHS: Yes; Category: Chip SMD Resistors; Stock 1: 108; Pricing 1: 1=0.10000, 10=0.03300, 100=0.01330, 1000=0.00599, 2500=0.00520, 5000=0.00429 (USD); Size Code: 0402; Terminal Finish: Nickel; Package Shape: Rectangular; Resistor Type: FIXED RESISTOR; Rated Power Dissipation (P): 100mW; Technology: METAL GLAZE/THICK FILM; Working Voltage: 50V; Construction: Rectangular; Package Style: SMTMeter; JESD-609 Code: e3; RoHS Compliant: Yes; ComponentLink1URL: https://datasheet.ciiva.com:443/pdfs/VipMasterIC/IC/PANA/PANA-S-A0009889626/PANA-S-A0009889626-1.pdf?src-supplier=IHS+Markit; ComponentLink1Description: https://datasheet.ciiva.com:443/pdfs/VipMasterIC/IC/PANA/PANA-S-A0009889626/PANA-S-A0009889626-1.pdf?src-supplier=IHS+Markit; ComponentLink2URL: https://datasheet.ciiva.com/11821/0900766b80f80784-11821171.pdf?src-supplier=RSComponents; ComponentLink2Description: https://datasheet.ciiva.com/11821/0900766b80f80784-11821171.pdf?src-supplier=RSComponents; ComponentLink3URL: https://datasheet.ciiva.com/27055/1987020-27055643.pdf?src-supplier=Jameco; ComponentLink3Description: https://datasheet.ciiva.com/27055/1987020-27055643.pdf?src-supplier=Jameco; ComponentLink4URL: https://datasheet.ciiva.com/43467/1678782-43467402.pdf?src-supplier=Farnell; ComponentLink4Description: https://datasheet.ciiva.com/43467/1678782-43467402.pdf?src-supplier=Farnell; ComponentLink5URL: https://datasheet.ciiva.com/28514/1678782-28514185.pdf?src-supplier=Element14; ComponentLink5Description: https://datasheet.ciiva.com/28514/1678782-28514185.pdf?src-supplier=Element14; ComponentLink6URL: https://datasheet.ciiva.com/24023/aoa0000ce2-24023017.pdf?src-supplier=Mouser; ComponentLink6Description: https://datasheet.ciiva.com/24023/aoa0000ce2-24023017.pdf?src-supplier=Mouser; ComponentLink7URL: https://datasheet.ciiva.com/16782/70260748-16782590.pdf?src-supplier=Allied+Electronics; ComponentLink7Description: https://datasheet.ciiva.com/16782/70260748-16782590.pdf?src-supplier=Allied+Electronics; ComponentLink8URL: https://datasheet.ciiva.com/16786/70260748-16786734.pdf?src-supplier=Allied+Electronics; ComponentLink8Description: https://datasheet.ciiva.com/16786/70260748-16786734.pdf?src-supplier=Allied+Electronics; ComponentLink9URL: https://datasheet.ciiva.com/9194/aoa0000ce2-9194142.pdf?src-supplier=Avnet; ComponentLink9Description: https://datasheet.ciiva.com/9194/aoa0000ce2-9194142.pdf?src-supplier=Avnet; ComponentLink10URL: https://datasheet.ciiva.com/16199/aoa0000ce2-16199478.pdf?src-supplier=Future+Electronics; ComponentLink10Description: https://datasheet.ciiva.com/16199/aoa0000ce2-16199478.pdf?src-supplier=Future+Electronics; ComponentLink11URL: https://datasheet.ciiva.com/48531/aoa0000ce2-48531069.pdf?src-supplier=Avnet; ComponentLink11Description: https://datasheet.ciiva.com/48531/aoa0000ce2-48531069.pdf?src-supplier=Avnet; ComponentLink12URL: https://datasheet.ciiva.com/30201/aoa0000ce2-30201022.pdf?src-supplier=Onlinecomponents.com; ComponentLink12Description: https://datasheet.ciiva.com/30201/aoa0000ce2-30201022.pdf?src-supplier=Onlinecomponents.com
R50 R52 = CMP-1011-00531-2: Manufacturer: Yageo / Phycomp; Part Number: RC0402FR-071K6L; Tolerance: 1%; Rated Power Dissipation (P): 62.5mW; Value: 1.6 kOhm; Temperature Coefficient: 100ppm/°C; Working Voltage: 50V; Rated Temperature: 70°C; Additional Feature: LASER TRIMMABLE; Package Height: 0.35mm; Package Length: 1mm; Package Width: 0.5mm; Supplier 1: Digi-Key; Supplier Part Number 1: YAG3045CT-ND; Manufacturer Part Number: RC0402FR-071K6L; RoHS: Yes; Category: Chip SMD Resistors; Stock 1: 492226; Pricing 1: 1=0.10000, 10=0.01500, 100=0.00600, 1000=0.00267, 2500=0.00232, 5000=0.00192 (USD); Mount: Surface Mount; Number of Pins: 2; Size Code: 0402; Terminal Finish: Nickel; Package Shape: Rectangular; Min Operating Temperature: -55°C; Max Operating Temperature: 155°C; Resistor Type: FIXED RESISTOR; Technology: METAL GLAZE/THICK FILM; Construction: Chip; Package Style: SMTMeter; Packaging: Tape and Reel; Termination: Wraparound; JESD-609 Code: e3; REACH SVHC: Yes; RoHS Compliant: Yes; ComponentLink1URL: https://datasheet.ciiva.com:443/pdfs/VipMasterIC/IC/YAGO/YAGO-S-A0008145938/YAGO-S-A0008145938-1.pdf?src-supplier=IHS+Markit; ComponentLink1Description: https://datasheet.ciiva.com:443/pdfs/VipMasterIC/IC/YAGO/YAGO-S-A0008145938/YAGO-S-A0008145938-1.pdf?src-supplier=IHS+Markit; ComponentLink2URL: https://datasheet.ciiva.com/7849/1018594-7849865.pdf?src-supplier=Element14; ComponentLink2Description: https://datasheet.ciiva.com/7849/1018594-7849865.pdf?src-supplier=Element14; ComponentLink3URL: https://datasheet.ciiva.com/7849/1018594-7849866.pdf?src-supplier=Element14; ComponentLink3Description: https://datasheet.ciiva.com/7849/1018594-7849866.pdf?src-supplier=Element14; ComponentLink4URL: https://datasheet.ciiva.com/8895/pyu-rc0402-51-rohs-l-6-8895221.pdf?src-supplier=Avnet; ComponentLink4Description: https://datasheet.ciiva.com/8895/pyu-rc0402-51-rohs-l-6-8895221.pdf?src-supplier=Avnet; ComponentLink5URL: https://datasheet.ciiva.com/15189/getdatasheetpartid-329238-15189373.pdf?src-supplier=Verical; ComponentLink5Description: https://datasheet.ciiva.com/15189/getdatasheetpartid-329238-15189373.pdf?src-supplier=Verical
R51 R53 = CMP-06022-000003-3: NTC Thermistor for Temperature Sensor, 0402, 10kΩ, 1%, 0.1mA, 5V; Manufacturer: Murata; Max Power Dissipation: 100mW; Value: 10 kOhm; Current Rating: 310uA; Rated Temperature: 25°C; Thermistor Application: TEMPERATURE COMPENSATION; Length: 1mm; Min Operating Temperature: -40°C; Max Operating Temperature: 125°C; Resistance Tolerance: 1%; Lead Free: Lead Free; Radiation Hardening: No; Case Code (Imperial): 0402; Depth: 0.5mm; Tolerance: 1%; Packaging: Tape and Reel; Package Quantity: 10000; Series: NCP; Number of Pins: 2; Power Rating: 100mW; Case/Package: 0402; Case Code (Metric): 1005; Height: 0.5mm; Termination: SMD/SMT; RoHS Compliant: Yes; REACH SVHC: No SVHC; Mount: Surface Mount; Supplier 1: Digi-Key; Supplier Part Number 1: 490-4801-1-ND; Manufacturer Part Number: NCP15XH103F03RC; RoHS: Yes; Category: Thermistors; Stock 1: 413279; Pricing 1: 1=0.16000, 5=0.14200, 10=0.12600, 25=0.11280, 50=0.09940, 100=0.08470, 500=0.07000, 1000=0.05861, 5000=0.05210 (USD); Package Shape: Rectangular; Terminal Finish: Nickel; Resistor Type: NTC THERMISTOR; Rated Power Dissipation (P): 100mW; Terminal Placement: Dual Ended; JESD-609 Code: e3; ComponentLink1URL: https://datasheet.ciiva.com:443/pdfs/VipMasterIC/IC/MURE/MURE-S-A0003530701/MURE-S-A0003530701-1.pdf?src-supplier=IHS+Markit; ComponentLink1Description: https://datasheet.ciiva.com:443/pdfs/VipMasterIC/IC/MURE/MURE-S-A0003530701/MURE-S-A0003530701-1.pdf?src-supplier=IHS+Markit
U1 = CMP-0253-00230-1: Dual-Channel Temperature Monitors and Fan-Speed Controller with Thermistor Inputs, -40 to 125 degC, 16-Pin SOP (E16+1), Pb-Free, Tape and Reel; Manufacturer: Maxim; Fan Cntrl.: PWM; Fan Controller Functions: Fan Failure Detector; Interface: 2-Wire/I2C/SMBus; Package Body Material: Plastic; Package Shape/Style: Rectangular; Number of Bits: 8; Operating Current-Max: 1mA; Output Interface Type: 2-Wire; Package Equivalence Code: SSOP16,.25; Power Supplies: 3.3/5V; Sensors/Transducers Type: TEMPERATURE SENSOR,SWITCH/DIGITAL OUTPUT,SERIAL; Max Supply Voltage: 5.5V; Min Supply Voltage: 3V; Body Breadth: 3.9inch; Body Height: 1.64mm; Body Length or Diameter: 8.65mm; ComponentLink3Description: Package Specification; PackageDescription: 16-Pin Quarter Small-Outline Package (E16+1), Body 4.90 x 3.89 mm, Pitch 0.635 mm; ComponentLink2URL: http://datasheets.maximintegrated.com/en/ds/MAX6615-MAX6616.pdf; PackageReference: E16+1; ComponentLink3URL: http://pdfserv.maximintegrated.com/package_dwgs/21-0055.PDF; Packing: Tape and Reel; Code_JEDEC: MO137; Mounting Technology: Surface Mount; PartNumber: MAX6615AEE+T; ComponentLink1URL: http://www.maximintegrated.com/; Generic Part Number: MAX6615; DatasheetVersion: Rev. 2; PackageVersion: Rev. K, 04/2012; ComponentLink1Description: Manufacturer URL; ComponentLink2Description: Datasheet; Supplier 1: Digi-Key; Supplier Part Number 1: MAX6615AEE+TCT-ND; Manufacturer Part Number: MAX6615AEE+T; RoHS: Yes; Category: Power Management ICs; Mount: Surface Mount; Number of Pins: 16; Terminal Finish: Tin; Min Operating Temperature: -40°C; Max Operating Temperature: 125°C; JESD-609 Code: e3; Technology: BICMOS; Termination: Solder; REACH SVHC: Yes; RoHS Compliant: Yes; ComponentLink4URL: https://datasheet.ciiva.com:443/pdfs/VipMasterIC/IC/MAXM/MAXMS09113/MAXMS09113-1.pdf?src-supplier=IHS+Markit; ComponentLink4Description: https://datasheet.ciiva.com:443/pdfs/VipMasterIC/IC/MAXM/MAXMS09113/MAXMS09113-1.pdf?src-supplier=IHS+Markit; ComponentLink5URL: https://datasheet.ciiva.com/3279/max6615-max6616-3279622.pdf?src-supplier=Avnet; ComponentLink5Description: https://datasheet.ciiva.com/3279/max6615-max6616-3279622.pdf?src-supplier=Avnet; ComponentLink6URL: https://datasheet.ciiva.com/14083/max6615-max6616-14083689.pdf?src-supplier=Digi-Key; ComponentLink6Description: https://datasheet.ciiva.com/14083/max6615-max6616-14083689.pdf?src-supplier=Digi-Key; ComponentLink7URL: https://datasheet.ciiva.com/13952/max6615-max6616-13952058.pdf?src-supplier=Digi-Key; ComponentLink7Description: https://datasheet.ciiva.com/13952/max6615-max6616-13952058.pdf?src-supplier=Digi-Key; ComponentLink8URL: https://datasheet.ciiva.com/13952/max6615-max6616-13952059.pdf?src-supplier=Digi-Key; ComponentLink8Description: https://datasheet.ciiva.com/13952/max6615-max6616-13952059.pdf?src-supplier=Digi-Key
X1 X2 = 3-647168-4: Board Connector, 4 Contact(s), 1 Row(s), Male, Straight, 0.1 inch Pitch, Locking, Black Insulator, Plug; Manufacturer: TE Connectivity; Manufacturer Part Number: 3-647166-4; Manufacturer Series: 647166; Option: General Purpose; Filter Feature: No; Number of Rows Loaded: 1; Number of Contacts: 4; Contact Pattern: RECTANGULAR; Contact Resistance: 10mR; Contact Style: SQ PIN-SKT; Dielectric Withstanding Voltage (AC): 750V; Durability: 25Cycles; Insertion Force-Max: 8.896N; Insulation Resistance: 5GR; Polarization Key: POLARIZED HOUSING; Withdrawl Force-Min: 3.614N; Number Of PCB Rows: 2; PCB Contact Pattern: STAGGERED; Body Breadth: 0.25inch; Body Depth: 0.347inch; Body Length: 0.4inch; Mounting Option 2: FRICTION LOCK; PCB Contact Row Spacing: 2.9972mm; Reference Standard: UL; Reliability: COMMERCIAL; Supplier 1: Digi-Key; Supplier Part Number 1: A110803-ND; RoHS: Yes; Category: Connectors; Stock 1: 3619; Pricing 1: 1=2.42000, 10=2.10700, 100=1.88280, 500=1.56900, 1000=1.34485, 5000=1.19243 (USD); Mount: Board; Contact Finish - Mating: NOT SPECIFIED; Insulation Color: Black; Insulation Material: Nylon; Min Operating Temperature: -55°C; Max Operating Temperature: 105°C; Connector Type: BOARD CONNECTOR; Contact Gender: Male; Mixed Contacts: No; JESD-609 Code: e3; Termination: SMD/SMT; Body/Shell Style: PLUG; Mounting Style: STRAIGHT; Number Of Connectors: 1; Mating Contact Pitch: 0.1inch; Mounting Option 1: LOCKING; Terminal Pitch: 2.54mm; RoHS Compliant: Yes; DIN Conformance: No; IEC Conformance: No; MIL Conformance: No; Reach SVHC Compliant: Yes; ComponentLink1URL: https://datasheet.ciiva.com:443/pdfs/VipMasterIC/IC/TYEL/TYEL-S-A0008869674/TYEL-S-A0008865685-1.pdf?src-supplier=IHS+Markit; ComponentLink1Description: https://datasheet.ciiva.com:443/pdfs/VipMasterIC/IC/TYEL/TYEL-S-A0008869674/TYEL-S-A0008865685-1.pdf?src-supplier=IHS+Markit; ComponentLink2URL: https://datasheet.ciiva.com/16216/eng-ds-82056-mta-0608-16216388.pdf?src-supplier=Future+Electronics; ComponentLink2Description: https://datasheet.ciiva.com/16216/eng-ds-82056-mta-0608-16216388.pdf?src-supplier=Future+Electronics; ComponentLink3URL: https://datasheet.ciiva.com/9525/eng-ds-82056-mta-0608-9525559.pdf?src-supplier=Avnet; ComponentLink3Description: https://datasheet.ciiva.com/9525/eng-ds-82056-mta-0608-9525559.pdf?src-supplier=Avnet